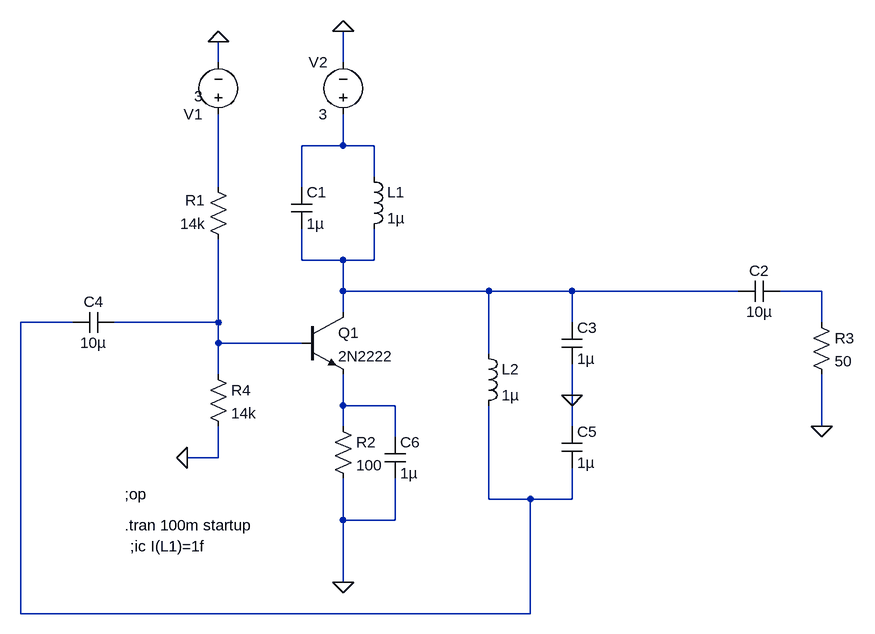
[diagram p0: schematic osc-colpin.asc]
osc-colpin.asc, the LTspice schematic file:
Version 4
SHEET 1 984 680
WIRE 0 -304 0 -336
WIRE 192 -304 192 -352
WIRE 192 -176 192 -224
WIRE 192 -176 128 -176
WIRE 240 -176 192 -176
WIRE 240 -128 240 -176
WIRE 0 -112 0 -224
WIRE 128 -112 128 -176
WIRE 128 0 128 -48
WIRE 192 0 128 0
WIRE 240 0 240 -48
WIRE 240 0 192 0
WIRE 192 48 192 0
WIRE 416 48 192 48
WIRE 544 48 416 48
WIRE 800 48 544 48
WIRE 928 48 864 48
WIRE 192 80 192 48
WIRE -224 96 -304 96
WIRE 0 96 0 -32
WIRE 0 96 -160 96
WIRE 544 96 544 48
WIRE 928 96 928 48
WIRE 0 128 0 96
WIRE 128 128 0 128
WIRE 416 144 416 48
WIRE 0 176 0 128
WIRE 544 208 544 160
WIRE 192 224 192 176
WIRE 272 224 192 224
WIRE 192 256 192 224
WIRE 544 256 544 208
WIRE 928 256 928 176
WIRE 272 272 272 224
WIRE 0 304 0 256
WIRE 0 304 -48 304
WIRE 416 368 416 224
WIRE 480 368 416 368
WIRE 544 368 544 320
WIRE 544 368 480 368
WIRE 192 400 192 336
WIRE 272 400 272 336
WIRE 272 400 192 400
WIRE 192 496 192 400
WIRE -304 544 -304 96
WIRE 480 544 480 368
WIRE 480 544 -304 544
FLAG 192 -352 0
FLAG 0 -336 0
FLAG 192 496 0
FLAG 928 256 0
FLAG -48 304 0
FLAG 544 208 0
SYMBOL npn 128 80 R0
SYMATTR InstName Q1
SYMATTR Value 2N2222
SYMBOL res 16 -16 R180
WINDOW 0 36 76 Left 2
WINDOW 3 36 40 Left 2
SYMATTR InstName R1
SYMATTR Value 14k
SYMBOL voltage 0 -208 R180
WINDOW 3 24 44 Left 2
WINDOW 123 0 0 Left 0
WINDOW 39 0 0 Left 0
SYMATTR Value 3
SYMATTR InstName V1
SYMBOL voltage 192 -208 R180
WINDOW 0 24 96 Left 2
WINDOW 3 24 16 Left 2
WINDOW 123 0 0 Left 0
WINDOW 39 0 0 Left 0
SYMATTR InstName V2
SYMATTR Value 3
SYMBOL ind 224 -144 R0
SYMATTR InstName L1
SYMATTR Value 1µ
SYMBOL cap 112 -112 R0
SYMATTR InstName C1
SYMATTR Value 1µ
SYMBOL cap 800 64 R270
WINDOW 0 32 32 VTop 2
WINDOW 3 0 32 VBottom 2
SYMATTR InstName C2
SYMATTR Value 10µ
SYMBOL res 912 80 R0
SYMATTR InstName R3
SYMATTR Value 50
SYMBOL res -16 160 R0
SYMATTR InstName R4
SYMATTR Value 14k
SYMBOL cap 528 96 R0
SYMATTR InstName C3
SYMATTR Value 1µ
SYMBOL cap 528 256 R0
SYMATTR InstName C5
SYMATTR Value 1µ
SYMBOL ind 400 128 R0
SYMATTR InstName L2
SYMATTR Value 1µ
SYMBOL cap -160 80 R90
WINDOW 0 0 32 VBottom 2
WINDOW 3 32 32 VTop 2
SYMATTR InstName C4
SYMATTR Value 10µ
SYMBOL res 176 240 R0
SYMATTR InstName R2
SYMATTR Value 100
SYMBOL cap 256 272 R0
SYMATTR InstName C6
SYMATTR Value 1µ
TEXT -144 360 Left 2 !;op
TEXT -144 408 Left 2 !.tran 100m startup
TEXT -136 440 Left 2 !;ic I(L1)=1f

The netlist it stands for:
* osc-colpin.asc
Q1 N003 N006 N007 0 2N2222
R1 N006 N002 14k
V1 N002 0 3
V2 N001 0 3
L1 N001 N003 1µ
C1 N001 N003 1µ
C2 N003 N004 10µ
R3 N004 0 50
R4 N006 0 14k
C3 N003 0 1µ
C5 0 N005 1µ
L2 N003 N005 1µ
C4 N006 N005 10µ
R2 N007 0 100
C6 N007 0 1µ
.model NPN NPN
.model PNP PNP
.lib standard.bjt
;op
.tran 100m startup
;ic I(L1)=1f
.backanno
.end